# EAGLE design schema_mpb_1_1_COM (EAGLE 9.0.1)

## Sheet 1 of 2
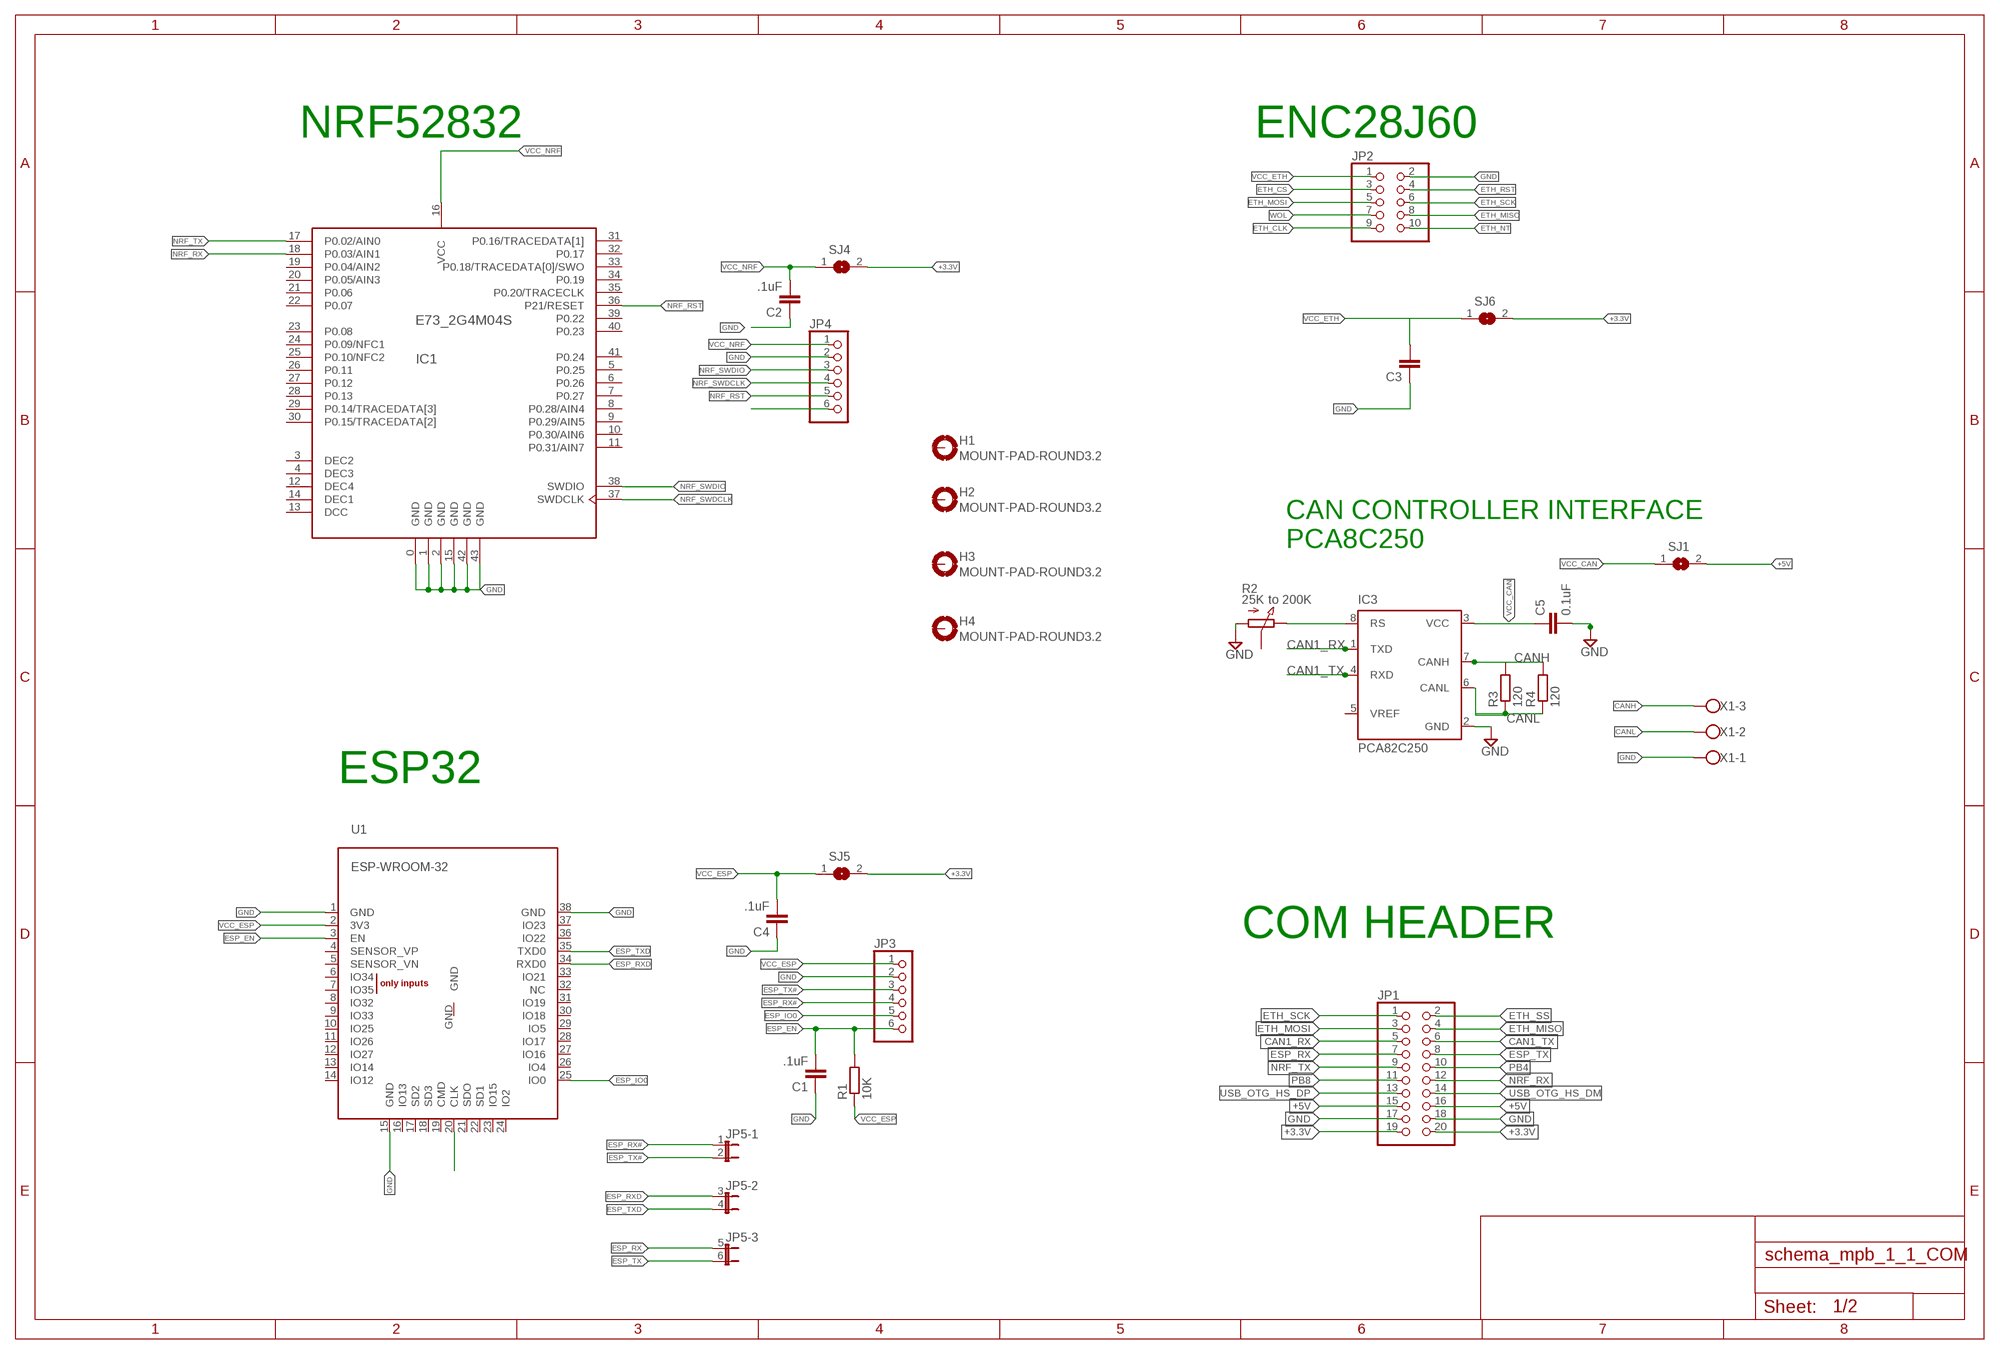
[diagram p0: schematic, sheet 1]

### Parts
C1  .1uF  C-EUC0603  [C0603]
C2  .1uF  C-EUC0603  [C0603]
C3  C-EUC0603  [C0603]
C4  .1uF  C-EUC0603  [C0603]
C5  0.1uF  C-EUC0805  [C0805]
H1  MOUNT-PAD-ROUND3.2  [3,2-PAD]
H2  MOUNT-PAD-ROUND3.2  [3,2-PAD]
H3  MOUNT-PAD-ROUND3.2  [3,2-PAD]
H4  MOUNT-PAD-ROUND3.2  [3,2-PAD]
IC1  E73_2G4M04S  [E73_2G4M04S]
IC3  PCA82C250  [DIL08]
JP1  PINHD-2X10  [2X10]
JP2  PINHD-2X5  [2X05]
JP3  PINHD-1X6  [1X06]
JP4  PINHD-1X6  [1X06]
JP5  JP3QE  [JP3Q]
R1  10K  R-EU_R0603  [R0603]
R2  25K to 200K  PC25  [PC25]
R3  120  R-EU_R0805  [R0805]
R4  120  R-EU_R0805  [R0805]
SJ1  SJW  [SJW]
SJ4  SJW  [SJW]
SJ5  SJW  [SJW]
SJ6  SJW  [SJW]
U1  ESP-WROOM-32  [ESP-WROOM-32]
X1  W237-103  [W237-103]

### Nets
+3.3V: JP1.19 JP1.20 SJ4.2 SJ5.2 SJ6.2
+5V: JP1.15 JP1.16 SJ1.2
CAN1_RX: IC3.1(TXD) JP1.5
CAN1_TX: IC3.4(RXD) JP1.6
CANH: IC3.7(CANH) R3.2 R4.2 X1.3
CANL: IC3.6(CANL) R3.1 R4.1 X1.2
ESP_EN: C1.2 JP3.6 R1.2 U1.3(EN)
ESP_IO0: JP3.5 U1.25(IO0)
ESP_RX: JP1.7 JP5.5
ESP_RX#: JP3.4 JP5.1
ESP_RXD: JP5.3 U1.34(RXD0)
ESP_TX: JP1.8 JP5.6
ESP_TX#: JP3.3 JP5.2
ESP_TXD: JP5.4 U1.35(TXD0)
ETH_CLK: JP2.9
ETH_CS: JP2.3
ETH_MISO: JP1.4 JP2.8
ETH_MOSI: JP1.3 JP2.5
ETH_NT: JP2.10
ETH_RST: JP2.4
ETH_SCK: JP1.1 JP2.6
ETH_SS: JP1.2
GND: C1.1 C2.1 C3.1 C4.1 C5.2 IC1.0(GND) IC1.1(GND) IC1.2(GND) IC1.15(GND) IC1.42(GND) IC1.43(GND) IC3.2(GND) JP1.17 JP1.18 JP2.2 JP3.2 JP4.2 R2.A U1.1(GND) U1.15(GND) U1.38(GND) X1.1
N$1: IC3.8(RS) R2.E
N$7: JP4.6
N$12: U1.20(CLK)
NRF_RST: IC1.36(P21/RESET) JP4.5
NRF_RX: IC1.18(P0.03/AIN1) JP1.12
NRF_SWDCLK: IC1.37(SWDCLK) JP4.4
NRF_SWDIO: IC1.38(SWDIO) JP4.3
NRF_TX: IC1.17(P0.02/AIN0) JP1.9
PB4: JP1.10
PB8: JP1.11
USB_OTG_HS_DM: JP1.14
USB_OTG_HS_DP: JP1.13
VCC_CAN: C5.1 IC3.3(VCC) SJ1.1
VCC_ESP: C4.2 JP3.1 R1.1 SJ5.1 U1.2(3V3)
VCC_ETH: C3.2 JP2.1 SJ6.1
VCC_NRF: C2.2 IC1.16(VCC) JP4.1 SJ4.1
WOL: JP2.7
Unconnected: H1.B3,2(MOUNT) H2.B3,2(MOUNT) H3.B3,2(MOUNT) H4.B3,2(MOUNT) IC1.5(P0.25) IC1.6(P0.26) IC1.7(P0.27) IC1.8(P0.28/AIN4) IC1.9(P0.29/AIN5) IC1.10(P0.30/AIN6) IC1.11(P0.31/AIN7) IC1.19(P0.04/AIN2) IC1.20(P0.05/AIN3) IC1.21(P0.06) IC1.22(P0.07) IC1.23(P0.08) IC1.24(P0.09/NFC1) IC1.25(P0.10/NFC2) IC1.26(P0.11) IC1.27(P0.12) IC1.28(P0.13) IC1.29(P0.14/TRACEDATA[3]) IC1.30(P0.15/TRACEDATA[2]) IC1.31(P0.16/TRACEDATA[1]) IC1.32(P0.17) IC1.33(P0.18/TRACEDATA[0]/SWO) IC1.34(P0.19) IC1.35(P0.20/TRACECLK) IC1.39(P0.22) IC1.40(P0.23) IC1.41(P0.24) IC3.5(VREF) R2.S U1.4(SENSOR_VP) U1.5(SENSOR_VN) U1.6(IO34) U1.7(IO35) U1.8(IO32) U1.9(IO33) U1.10(IO25) U1.11(IO26) U1.12(IO27) U1.13(IO14) U1.14(IO12) U1.16(IO13) U1.17(SD2) U1.18(SD3) U1.19(CMD) U1.21(SDO) U1.22(SD1) U1.23(IO15) U1.24(IO2) U1.26(IO4) U1.27(IO16) U1.28(IO17) U1.29(IO5) U1.30(IO18) U1.31(IO19) U1.32(NC) U1.33(IO21) U1.36(IO22) U1.37(IO23) U1.GND

### Notes on the sheet
- NRF52832 | ENC28J60
- CAN CONTROLLER INTERFACE
  PCA8C250
- ESP32
- COM HEADER

## Sheet 2 of 2

## Power pins joined to a net without a drawn wire
DCC: IC1.13(DCC)
DEC1: IC1.14(DEC1)
DEC2: IC1.3(DEC2)
DEC3: IC1.4(DEC3)
DEC4: IC1.12(DEC4)

## Library data of the parts
C1-C5 = resistor:C-EU: CAPACITOR, European symbol
H1-H4 = holes:MOUNT-PAD-ROUND: MOUNTING PAD, round
IC1 = E73-2G4M04S:E73_2G4M04S: E73-2G4M04S nRF52832 based BLE module
IC3 = micro-philips:PCA82C250: CAN CONTROLLER INTERFACE; OC_FARNELL: 3692358; OC_NEWARK: unknown
JP1 = pinhead:PINHD-2X10: PIN HEADER
JP2 = pinhead:PINHD-2X5: PIN HEADER
JP3 JP4 = pinhead:PINHD-1X6: PIN HEADER
JP5 = jumper:JP3QE: JUMPER
R1 R3 R4 = resistor:R-EU_: RESISTOR, European symbol
R2 = pot-vitrohm:PC25: VITROHM POTENTIOMETER; MF: CLAROSTAT; MPN: 308NPC25KS; OC_FARNELL: 1440998; OC_NEWARK: 03F7518
SJ1 SJ4-SJ6 = jumper:SJ: SMD solder JUMPER
U1 = esp32:ESP-WROOM-32
X1 = con-wago-500:W237-103: WAGO SCREW CLAMP; MPN: 237-103; OC_FARNELL: unknown; OC_NEWARK: 18M7116

## Board
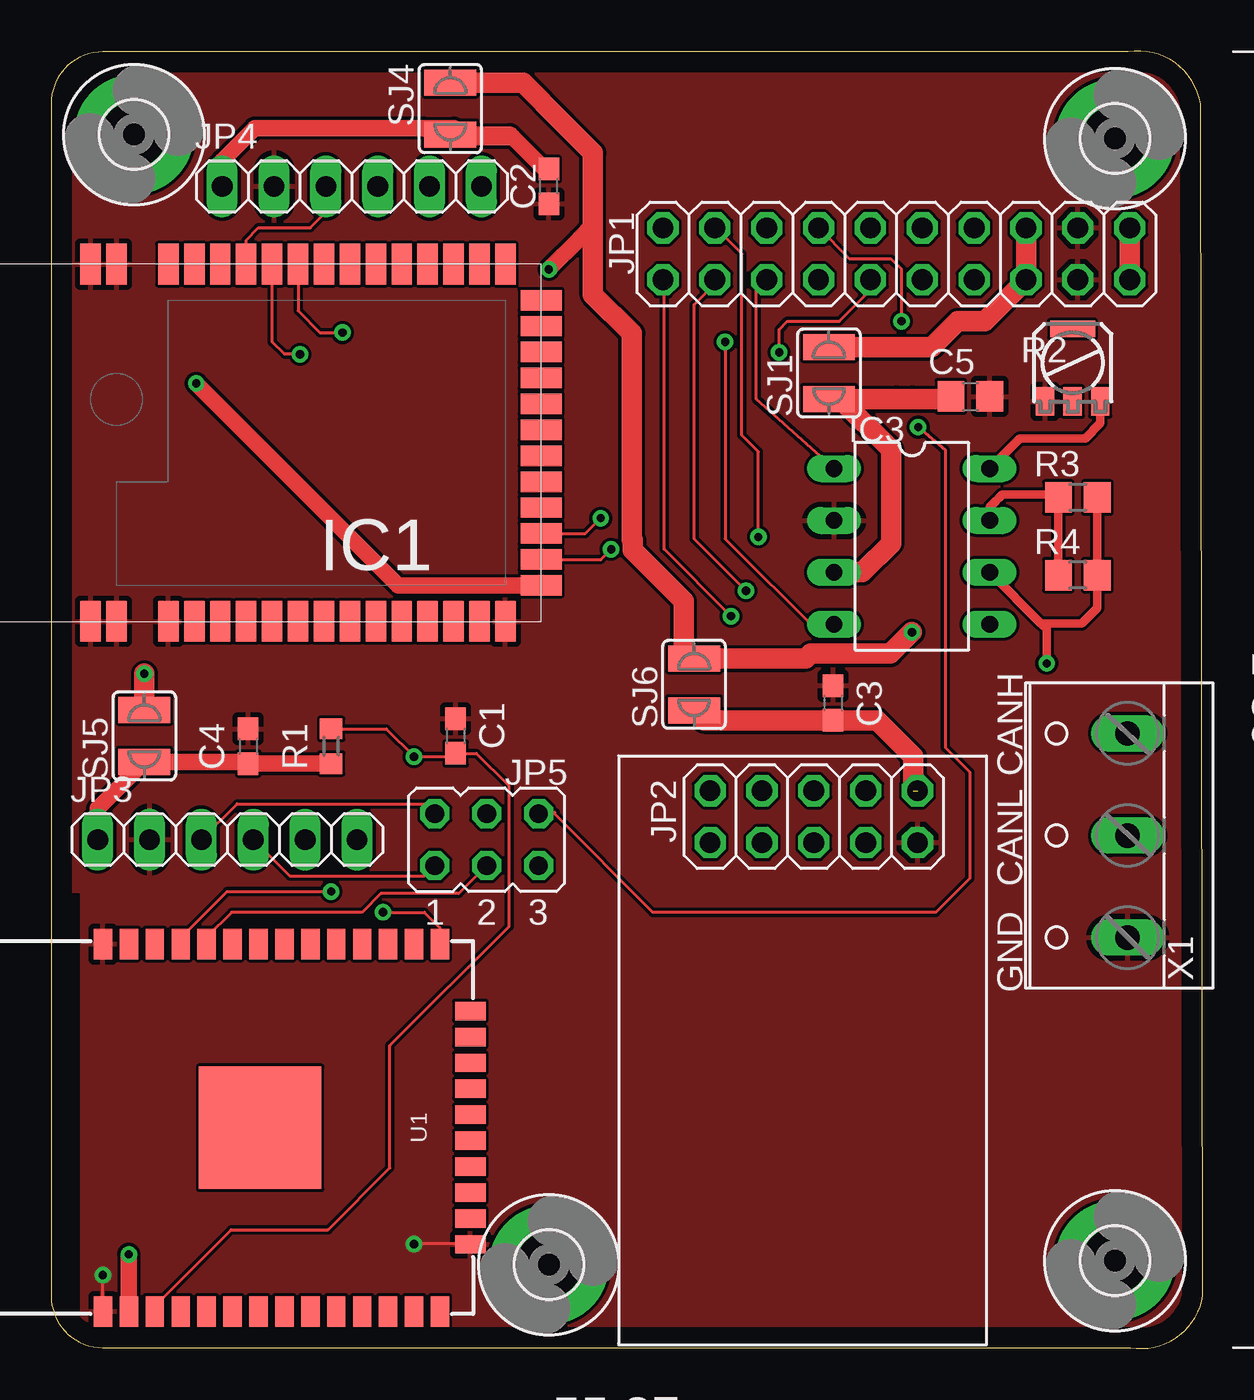
[diagram p1: board, top side]
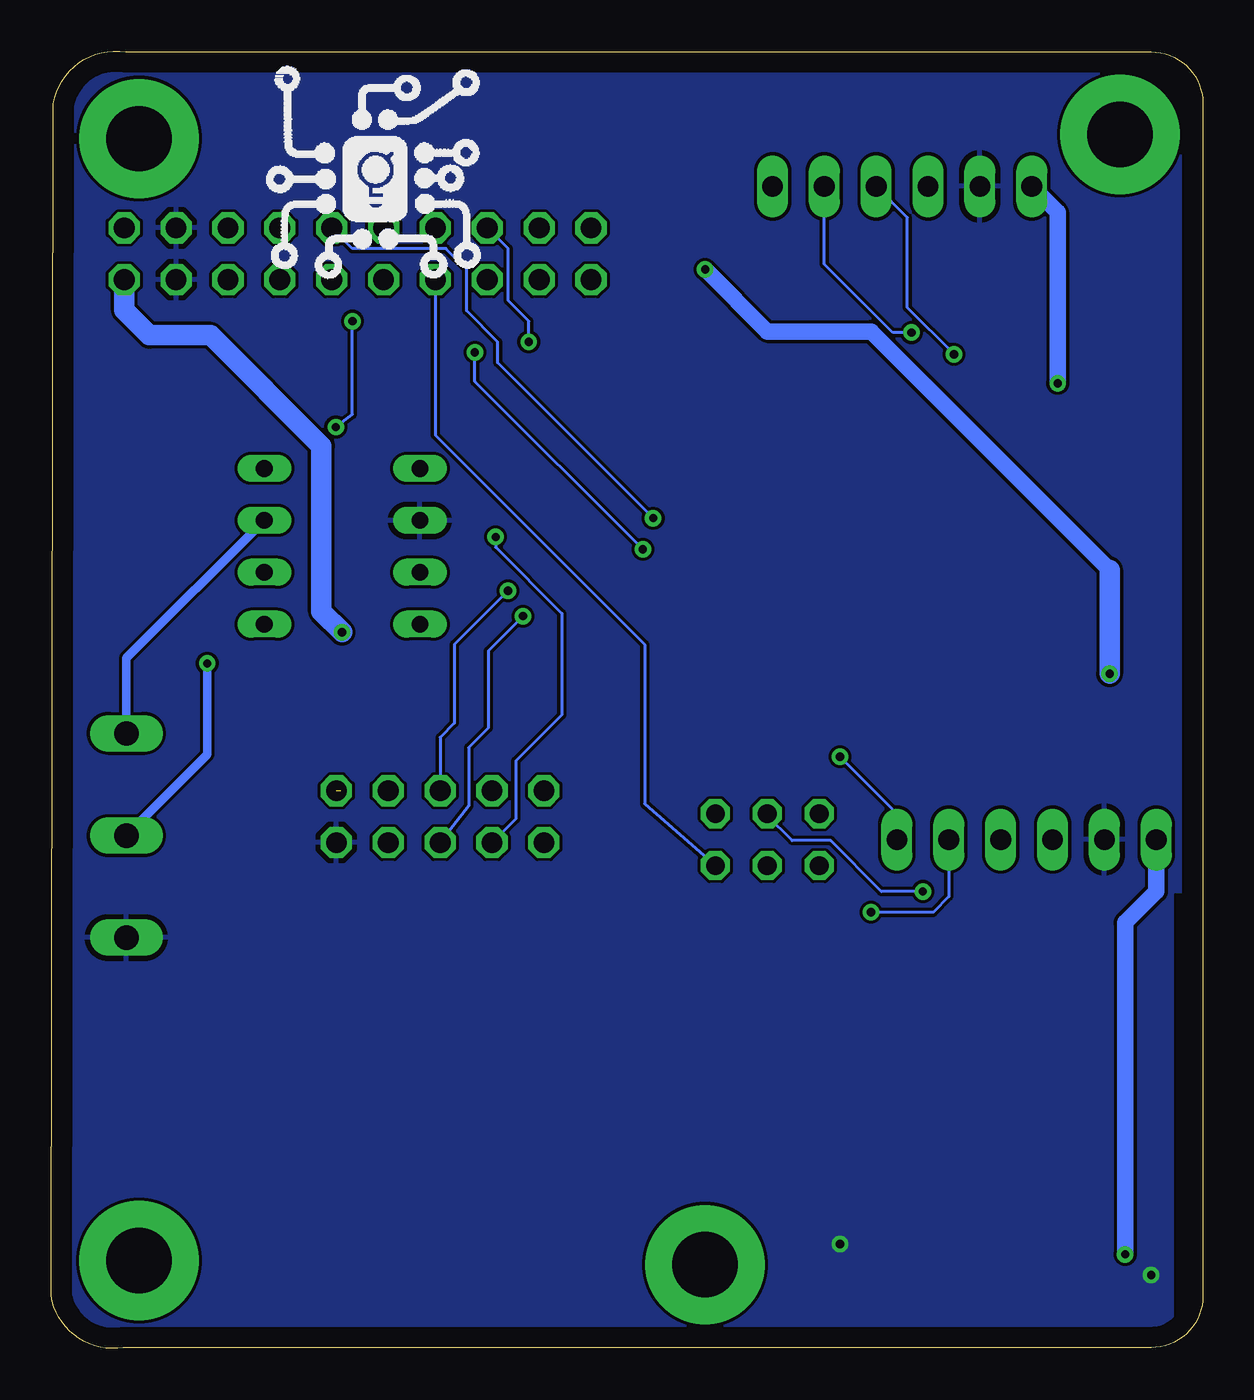
[diagram p2: board, bottom side, seen from below]

Size 56.42 x 63.57 mm. Coordinates in mm from the lower left corner, seen from the top.
Outline: 0,60.99 0,2.58 arc90 2.54,0.04 52.88,0.04 arc90 56.42,2.59 56.3,60.99 arc90 52.76,63.53 2.54,63.53 arc90 0,60.99
Copper layers (1*16): Top 0.035mm / dielectric 1.5mm / Bottom 0.035mm
Design rules "default": minimum track width 6mil, minimum drill 0.35mm, track to track 6mil, track to pad 6mil, pad to pad 6mil, via to via 6mil, smd to smd 6mil, copper to edge 40mil, drill to drill 6mil, minimum pad ring 10mil, minimum via ring 8mil, stop-mask expansion 4mil, vias tented up to drill 0mil, thermal gap 10mil

### Footprints (pad centres in the part's own frame; a part is rotated, then mirrored left to right if it is on the bottom)
C0603 = smd 1.1 x 1: 1 -0.85,0; 2 0.85,0
C0805 = smd 1.3 x 1.5: 1 -0.95,0; 2 0.95,0
3,2-PAD = drill 3.2 pad 5.842: B3,2 0,0
E73_2G4M04S = smd 1 x 2: 0 22.065,17.5; 1 20.795,17.5; 2 18.255,17.5; 3 16.985,17.5; 4 15.715,17.5; 5 14.445,17.5; 6 13.175,17.5; 7 11.905,17.5; 8 10.635,17.5; 9 9.365,17.5; 10 8.095,17.5; 11 6.825,17.5; 12 5.555,17.5; 13 4.285,17.5; 14 3.015,17.5; 15 1.745,17.5; 28 1.745,0; 29 3.015,0; 30 4.285,0; 31 5.555,0; 32 6.825,0; 33 8.095,0; 34 9.365,0; 35 10.635,0; 36 11.905,0; 37 13.175,0; 38 14.445,0; 39 15.715,0; 40 16.985,0; 41 18.255,0; 42 20.795,0; 43 22.065,0 | smd 2 x 1: 16 0,15.735; 17 0,14.465; 18 0,13.195; 19 0,11.925; 20 0,10.655; 21 0,9.385; 22 0,8.115; 23 0,6.845; 24 0,5.575; 25 0,4.305; 26 0,3.035; 27 0,1.765
DIL08 = drill 0.813 long: 1 -3.81,-3.81; 2 -1.27,-3.81; 3 1.27,-3.81; 4 3.81,-3.81; 5 3.81,3.81; 6 1.27,3.81; 7 -1.27,3.81; 8 -3.81,3.81
2X10 = drill 1.016 octagon: 1 -11.43,-1.27; 2 -11.43,1.27; 3 -8.89,-1.27; 4 -8.89,1.27; 5 -6.35,-1.27; 6 -6.35,1.27; 7 -3.81,-1.27; 8 -3.81,1.27; 9 -1.27,-1.27; 10 -1.27,1.27; 11 1.27,-1.27; 12 1.27,1.27; 13 3.81,-1.27; 14 3.81,1.27; 15 6.35,-1.27; 16 6.35,1.27; 17 8.89,-1.27; 18 8.89,1.27; 19 11.43,-1.27; 20 11.43,1.27
2X05 = drill 1.016 octagon: 1 -5.08,-1.27; 2 -5.08,1.27; 3 -2.54,-1.27; 4 -2.54,1.27; 5 0,-1.27; 6 0,1.27; 7 2.54,-1.27; 8 2.54,1.27; 9 5.08,-1.27; 10 5.08,1.27
1X06 = drill 1.016 long: 1 -6.35,0; 2 -3.81,0; 3 -1.27,0; 4 1.27,0; 5 3.81,0; 6 6.35,0
JP3Q = drill 0.914 octagon: 1 -2.54,-1.27; 2 -2.54,1.27; 3 0,-1.27; 4 0,1.27; 5 2.54,-1.27; 6 2.54,1.27
R0603 = smd 1 x 1.1: 1 -0.85,0; 2 0.85,0
PC25 = smd 2.2 x 0.8: 4 0,1.65 | smd 0.9 x 1.4: A -1.35,-1.9; E 1.35,-1.9; S 0,-1.9
R0805 = smd 1.3 x 1.5: 1 -0.95,0; 2 0.95,0
SJW = smd 1.27 x 2.54: 1 -1.27,0; 2 1.27,0
ESP-WROOM-32 = smd 0.9 x 1.5: 1 7.7,9; 2 6.43,9; 3 5.16,9; 4 3.89,9; 5 2.62,9; 6 1.35,9; 7 0.08,9; 8 -1.19,9; 9 -2.46,9; 10 -3.73,9; 11 -5,9; 12 -6.27,9; 13 -7.54,9; 14 -8.81,9; 25 -8.81,-9; 26 -7.54,-9; 27 -6.27,-9; 28 -5,-9; 29 -3.73,-9; 30 -2.46,-9; 31 -1.19,-9; 32 0.08,-9; 33 1.35,-9; 34 2.62,-9; 35 3.89,-9; 36 5.16,-9; 37 6.43,-9; 38 7.7,-9 | smd 1.5 x 0.9: 15 -10.3,5.715; 16 -10.3,4.445; 17 -10.3,3.175; 18 -10.3,1.905; 19 -10.3,0.635; 20 -10.3,-0.635; 21 -10.3,-1.905; 22 -10.3,-3.175; 23 -10.3,-4.445; 24 -10.3,-5.715 | smd 6 x 6: GND 0,0
W237-103 = drill 1.194 long: 1 -5,-1.29; 2 0,-1.29; 3 5,-1.29

### Placement (x,y rotation side)
C1  19.81,30.01 270 top
C2  24.38,56.94 90 top
C3  38.3,31.63 270 top
C4  9.65,29.5 270 top
C5  45.02,46.65 0 top
H1  24.38,4.1 0 top
H2  52.11,59.28 0 top
H3  52.11,4.3 0 top
H4  4.06,59.48 0 top
IC1  24,53.13 180 top
IC3  42.16,39.3 270 top
JP1  41.4,53.63 0 top
JP2  37.36,26.06 180 top
JP3  8.64,24.93 0 top
JP4  14.73,56.94 0 top
JP5  21.34,24.93 0 top
R1  13.72,29.5 90 top
R2  50.04,48.3 0 top
R3  50.29,41.7 180 top
R4  50.29,37.89 180 top
SJ1  38.1,47.79 90 top
SJ4  19.56,60.75 90 top
SJ5  4.57,30.01 90 top
SJ6  31.5,32.54 90 top
U1  10.24,10.82 180 top
X1  51.44,25.13 90 top

### Tracks (layer width: path | path; a pad name or v marks a point on that pad's centre or on a via)
+3.3V  (via drill 0.4)
  Top 0.813: 26.54,51.64 26.54,54.88 | v24.38,52.87 25.86,54.35 | 25.86,54.35 26.02,54.35 26.54,54.88 | 23.11,62.02 25.05,60.09 | 26.54,55.03 26.54,54.88 | 25.86,54.35 26.54,55.03 | 26.54,55.03 26.54,58.59
  Top 1.016: JP1.20 JP1.19 | v4.57,33.06 SJ5.2 | v42.16,35.09 41.11,34.04 37.2,34.04 36.97,33.81 SJ6.2 30.99,34.31 30.99,36.62 28.5,39.11 28.5,39.6 28.45,39.64 28.45,49.74 26.54,51.64 26.54,58.59 25.05,60.09 23.12,62.01 23.11,62.01 | 23.11,62.02 SJ4.2
  Bottom 0.813: v24.38,52.87 21.34,49.82 16.26,49.82 4.57,38.14
  Bottom 1.016: 4.57,38.14 v4.57,33.06 | v42.16,35.09 43.18,36.11 43.18,44.22 48.6,49.64 51.6,49.64 52.83,50.87 JP1.19
+5V
  Top 1.016: SJ1.2 43.13,49.06 44.4,50.33 45.72,50.33 JP1.15 JP1.16
CAN1_RX
  Top 0.152: JP1.5 34.54,51.86 34.54,46.52 IC3.1
CAN1_TX  (via drill 0.4)
  Top 0.152: IC3.4 37.59,35.09 33.02,39.66 v33.02,49.32
  Bottom 0.152: v33.02,49.32 33.02,50.33 34.04,51.35 34.04,53.89 JP1.6
CANH
  Top 0.152: 49.38,37.89 49.38,41.7 R3.2 49.2,41.84 | 49.38,37.89 R4.2 | 49.34,37.92 49.38,37.89 | 46.3,41.54 46.4,41.64
  Top 0.406: IC3.7 45.97,41.21 46.3,41.54 | 46.4,41.64 46.6,41.84 49.2,41.84 | R3.2 49.34,37.92
  Bottom 0.406: IC3.7 52.73,33.82 X1.3
CANL  (via drill 0.4)
  Top 0.152: R3.1 51.21,41.7 51.21,37.89 R4.1 51.36,37.89
  Top 0.406: R3.1 51.24,38 51.36,37.89 | IC3.6 48.48,35.52 | 48.48,35.52 48.77,35.24 v48.77,33.57 | R4.1 51.24,36.28 50.48,35.52 48.48,35.52
  Bottom 0.406: v48.77,33.57 48.77,29.09 X1.2
ESP_EN  (via drill 0.4)
  Top 0.152: U1.3 5.18,1.87 5.18,2.17 8.82,5.82 13.58,5.82 16.6,8.84 16.6,14.84 22.43,20.68 22.43,27.56 20.83,29.16 C1.2 19.65,29 v17.78,29 16.42,30.35 R1.2 | 15.09,24.88 JP3.6
  Bottom 0.152: JP3.6 14.99,26.2 v17.78,29
ESP_IO0  (via drill 0.4)
  Top 0.152: U1.25 19.05,20.61 18.29,21.38 v16.26,21.38
  Bottom 0.152: JP3.5 12.45,22.14 13.21,21.38 v16.26,21.38
ESP_RX
  Bottom 0.152: JP1.7 37.59,44.74 27.34,34.49 27.34,26.68 JP5.5
ESP_RX#
  Top 0.152: JP3.4 11.68,23.15 18.29,23.15 JP5.1
ESP_RXD
  Top 0.152: U1.34 7.62,20.16 8.84,21.38 15.24,21.38 16.15,22.29 19.96,22.29 JP5.3
ESP_TX  (via drill 0.4)
  Top 0.152: v41.66,50.33 41.66,52.87 41.15,53.38 39.12,53.38 JP1.8 | JP5.6 23.93,26.25 24.69,26.25 24.64,26.2 29.46,21.38 43.34,21.38 45,23.04 45,28.24 43.8,29.44 43.8,44.02 v42.47,45.14
  Bottom 0.152: v42.47,45.14 41.66,45.76 v41.66,50.33
ESP_TX#
  Top 0.152: JP3.3 9.12,26.69 18.31,26.69 JP5.2
ESP_TXD  (via drill 0.4)
  Top 0.152: U1.35 6.4,19.85 6.4,20.16 8.64,22.39 v13.72,22.39
  Bottom 0.152: JP5.4 21.34,26.1 20.12,24.88 18.24,24.88 15.75,22.39 v13.72,22.39
ETH_MISO  (via drill 0.4)
  Top 0.152: JP1.4 32.61,54.85 33.83,53.63 33.83,44.74 34.64,43.93 v34.64,39.76
  Bottom 0.152: v34.64,39.76 34.64,39.26 31.4,36.01 31.4,31.04 33.65,28.79 33.65,25.95 JP2.8
ETH_MOSI  (via drill 0.4)
  Top 0.152: JP1.3 32.61,52.26 31.5,51.15 31.5,39.66 v34.04,37.12
  Bottom 0.152: v34.04,37.12 36.66,34.5 36.66,30.64 37.36,29.94 JP2.5
ETH_SCK  (via drill 0.4)
  Top 0.152: JP1.1 30.02,52.26 30.02,39.16 v33.3,35.88
  Bottom 0.152: JP2.6 35.96,26.58 35.96,29.44 35,30.4 35,34.18 v33.3,35.88
GND  (via drill 0.4)
  Top 0.152: U1.1 v2.54,3.6 | U1.15 20.52,5.12 v17.78,5.12
  pour Bottom: 52.45,0.55 2.79,0.55 arc-90 0.25,3.09 0.25,60.62 arc-90 2.79,63.16 52.45,63.16 arc-90 55.99,60.62 55.99,3.09 arc-90
  pour Top: 52.45,0.55 2.79,0.55 arc-90 0.25,3.09 0.25,60.62 arc-90 2.79,63.16 52.45,63.16 arc-90 55.99,60.62 55.99,3.09 arc-90
N$1
  Top 0.152: 51.39,46.24 R2.E
  Top 0.406: IC3.8 47.45,44.59 50.65,44.59 51.39,45.33 51.39,46.24
NRF_RST  (via drill 0.4)
  Top 0.152: IC1.36 12.1,50.84 13.16,49.78 v14.27,49.78
  Bottom 0.152: v14.27,49.78 15.19,49.78 18.54,53.13 JP4.5
NRF_RX  (via drill 0.4)
  Top 0.152: IC1.18 26.18,39.93 v26.92,40.68
  Bottom 0.152: JP1.12 41.66,53.89 37.08,53.89 36.07,52.87 36.07,50.84 34.54,49.32 34.54,48.3 v26.92,40.68
NRF_SWDCLK  (via drill 0.4)
  Top 0.152: IC1.37 10.83,49.32 11.44,48.71 v12.19,48.71
  Bottom 0.152: JP4.4 14.48,55.41 14.48,51 v12.19,48.71
NRF_SWDIO
  Top 0.152: IC1.38 9.56,54.3 10.16,54.9 12.7,54.9 13.46,55.67 JP4.3
NRF_TX  (via drill 0.4)
  Top 0.152: JP1.9 40.13,51.86 38.61,50.33 36.07,50.33 35.66,49.92 v35.66,48.81 | IC1.17 24.02,38.65 26.92,38.65 v27.43,39.16
  Bottom 0.152: v27.43,39.16 35.66,47.38 v35.66,48.81
VCC_CAN
  Top 0.152: 38.61,46.57 38.1,46.57 SJ1.1
  Top 0.305: SJ1.1 38.15,46.57 38.61,46.57
  Top 1.016: IC3.3 39.74,38.03 41.15,39.44 41.15,44.03 38.61,46.57 | SJ1.1 41.4,46.52 42.2,46.52 43.95,46.52 C5.1
VCC_ESP  (via drill 0.4)
  Top 0.813: R1.1 C4.2 9.56,28.74 SJ5.1 2.29,26.46 JP3.1 | v3.81,4.61 U1.2
  Bottom 0.813: JP3.1 2.29,22.39 3.81,20.87 v3.81,4.61
VCC_ETH  (1 unrouted)
  Top 1.016: SJ6.1 31.98,30.78 C3.2 40.46,30.78 42.24,29 42.24,27.33
VCC_NRF  (via drill 0.4)
  Top 0.152: 23.93,37.53 IC1.16
  Top 0.813: 22.61,59.35 24.17,57.79 C2.2 | JP4.1 8.38,58.21 9.97,59.8 18.24,59.8 | 18.24,59.8 SJ4.1 22.48,59.48 22.61,59.35 | v7.11,47.28 17,37.39 IC1.16 | 22.61,59.35 20.19,59.35 19.75,59.8 18.24,59.8
  Bottom 0.813: JP4.1 7.11,55.67 v7.11,47.28

### Text on the board
tPlace: CANH | CANL | GND